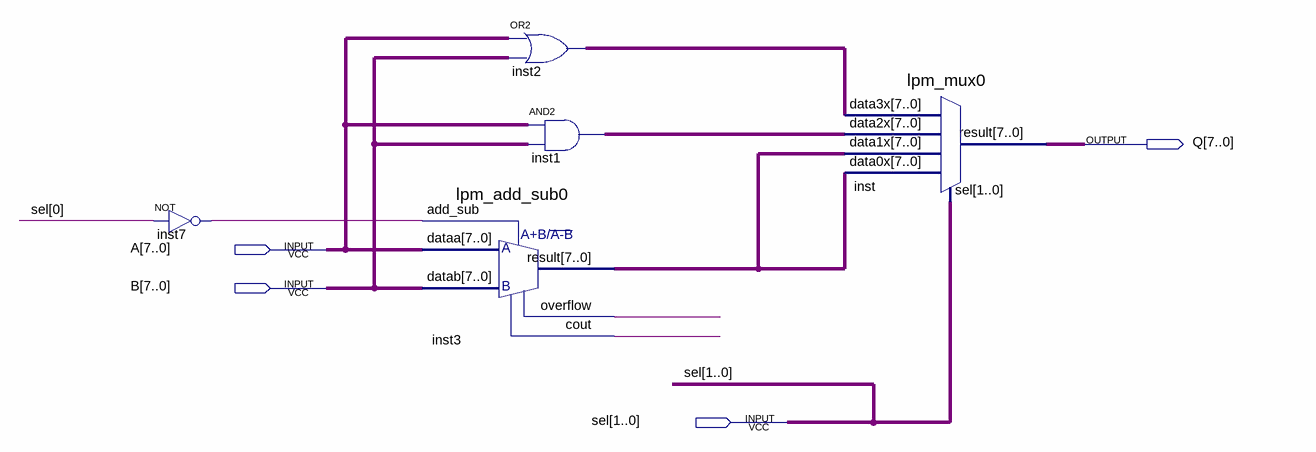
[diagram p0: schematic sheet]
// Quartus schematic test2021.bdf as structural Verilog: 5 symbols, 4 pins
module test2021 (
  input  [7:0] A,
  input  [7:0] B,
  input  [1:0] sel,
  output [7:0] Q
);

  wire inst3_cout, inst3_overflow, inst7_out;
  wire [7:0] inst1_out, inst2_out, inst3_result;

  not inst7 (inst7_out, sel[0]);
  lpm_add_sub0 inst3 (
    .dataa(A), .datab(B), .add_sub(inst7_out), .result(inst3_result), .overflow(inst3_overflow),
    .cout(inst3_cout));
  assign inst2_out = A | B;  // OR2 inst2, 8 bits wide
  assign inst1_out = A & B;  // AND2 inst1, 8 bits wide
  lpm_mux0 inst (
    .data3x(inst2_out), .data2x(inst1_out), .data1x(inst3_result), .data0x(inst3_result), .sel(sel),
    .result(Q));
endmodule
